# EAGLE board PL20_11 (EAGLE 4.01)
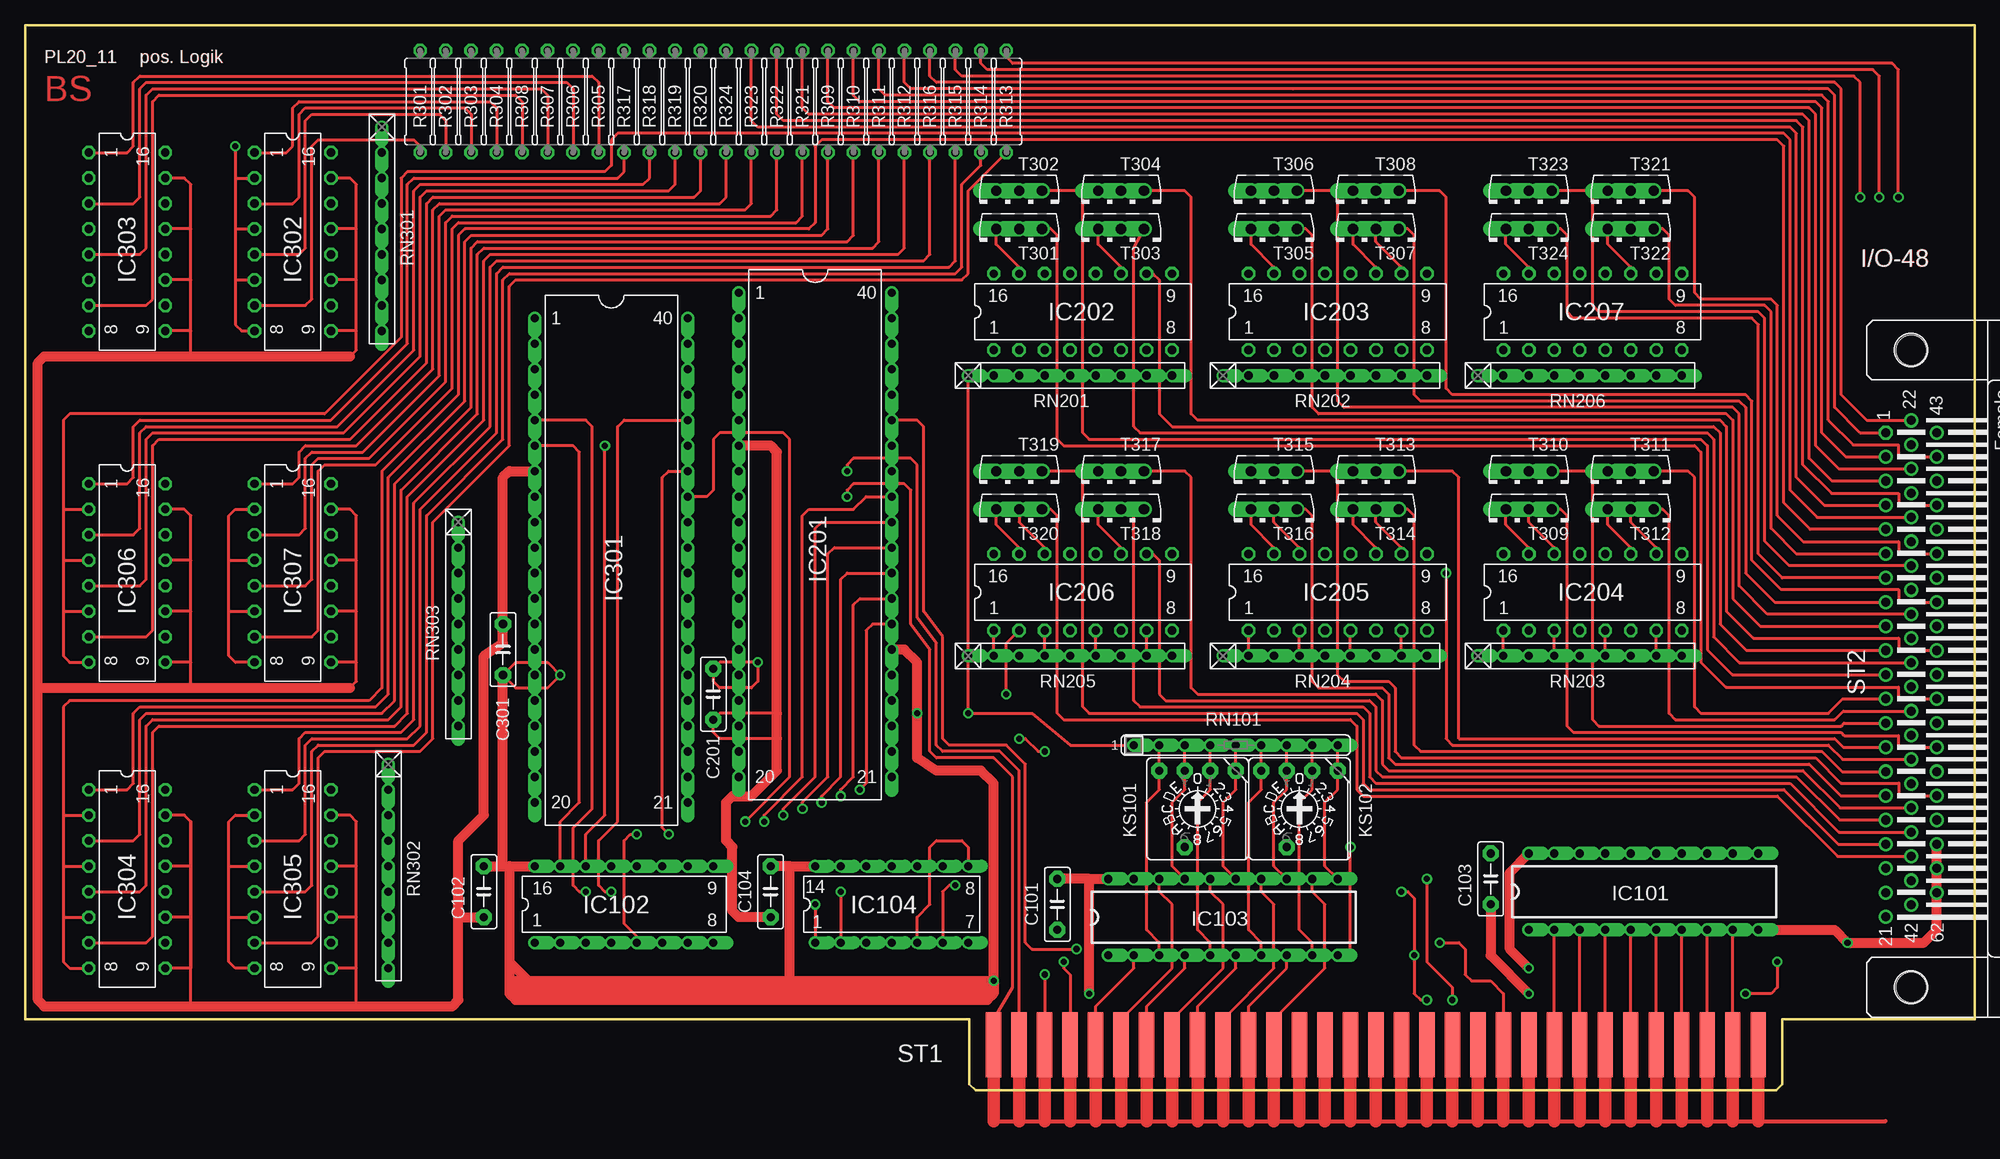
[diagram p3: board, top side]
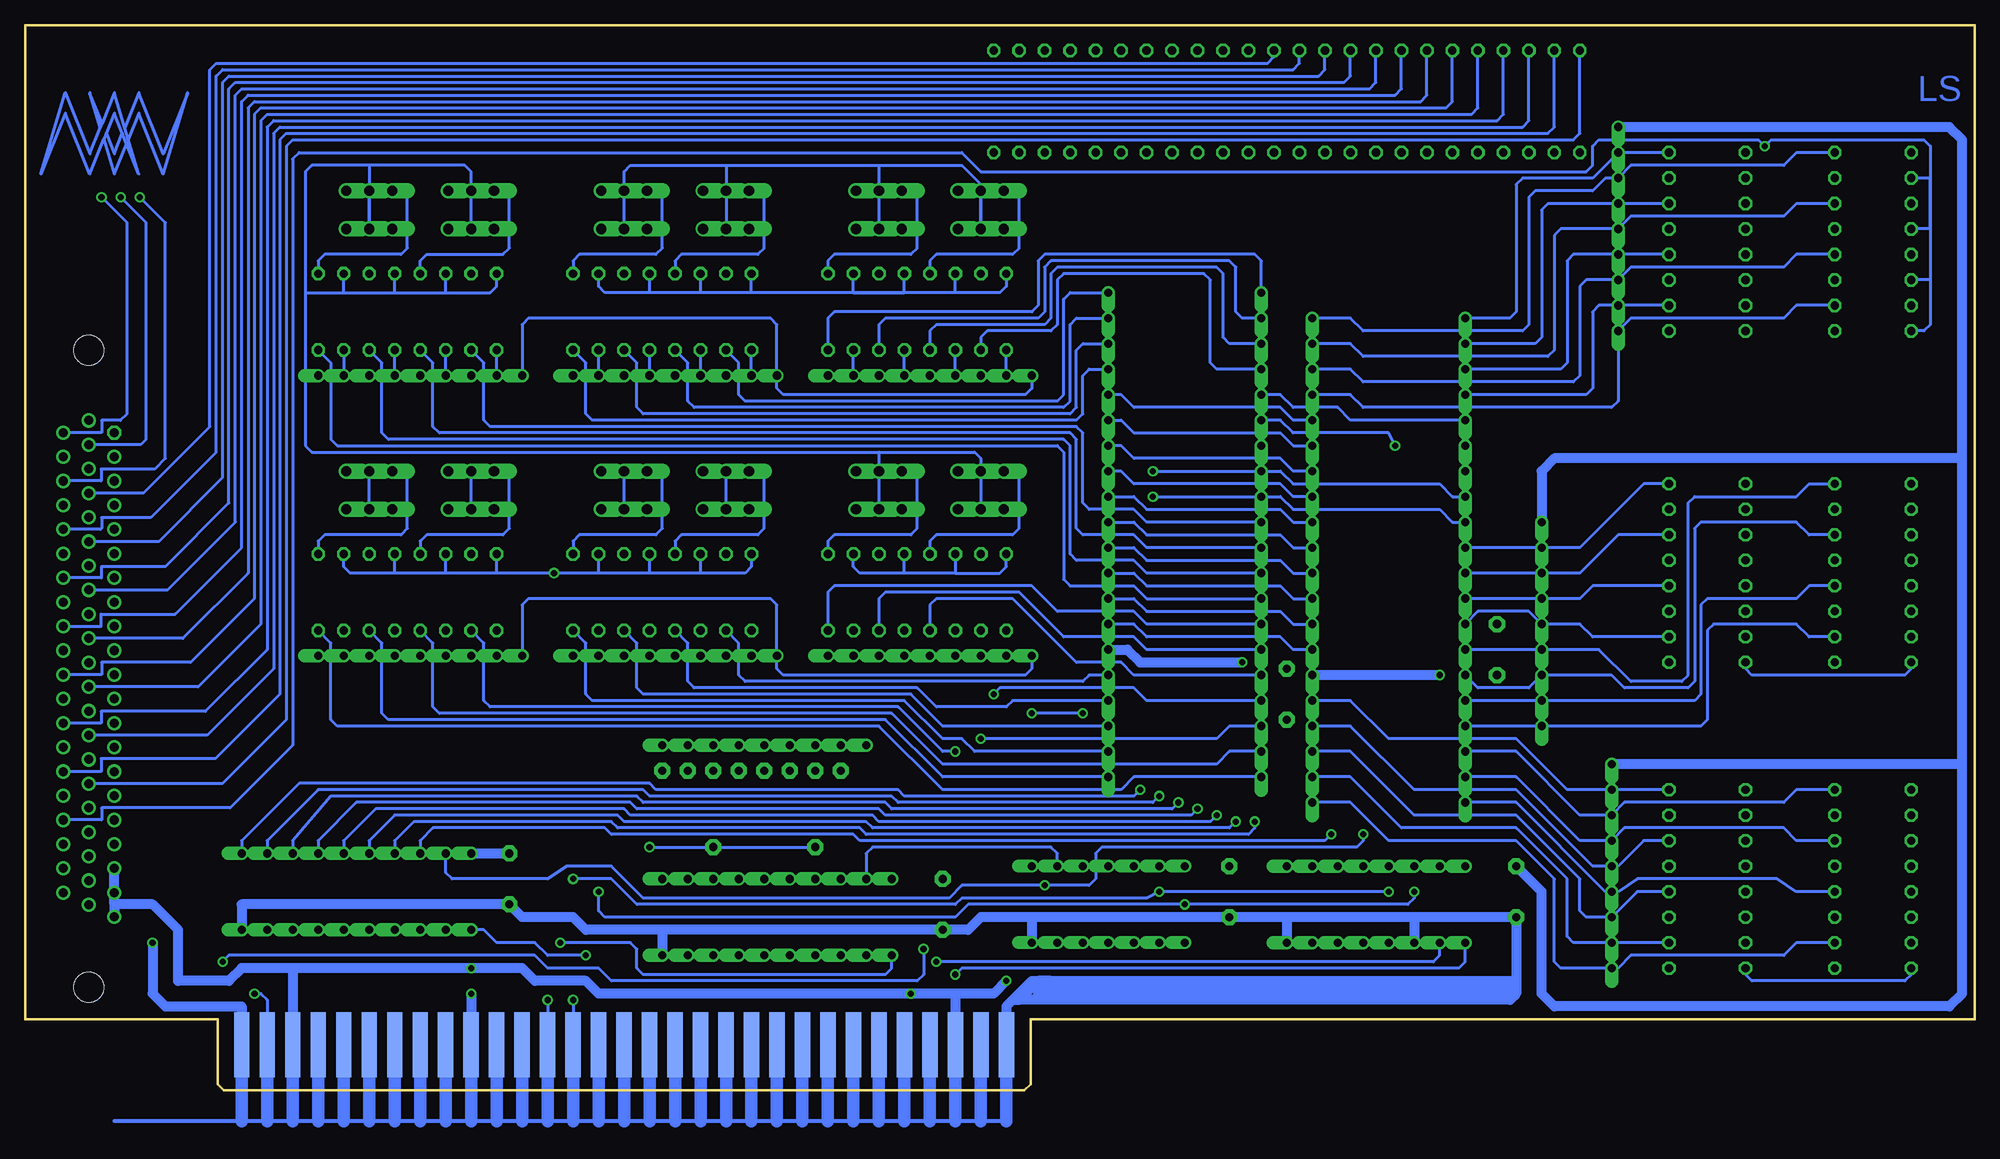
[diagram p4: board, bottom side, seen from below]

Size 194.31 x 106.17 mm. Coordinates in mm from the lower left corner, seen from the top.
Copper layers used: Top, Bottom

## Footprints (pad centres in the part's own frame; a part is rotated, then mirrored left to right if it is on the bottom)
C5B2,5 = drill 0.813 pad 1.6 octagon: 1 -2.54,0; 2 2.54,0
PDIP20 = drill 0.813 offset: 1 -11.43,-3.81; 2 -8.89,-3.81; 3 -6.35,-3.81; 4 -3.81,-3.81; 5 -1.27,-3.81; 6 1.27,-3.81; 7 3.81,-3.81; 8 6.35,-3.81; 9 8.89,-3.81; 10 11.43,-3.81; 11 11.43,3.81; 12 8.89,3.81; 13 6.35,3.81; 14 3.81,3.81; 15 1.27,3.81; 16 -1.27,3.81; 17 -3.81,3.81; 18 -6.35,3.81; 19 -8.89,3.81; 20 -11.43,3.81
DIL16 = drill 0.813 offset: 1 -8.89,-3.81; 2 -6.35,-3.81; 3 -3.81,-3.81; 4 -1.27,-3.81; 5 1.27,-3.81; 6 3.81,-3.81; 7 6.35,-3.81; 8 8.89,-3.81; 9 8.89,3.81; 10 6.35,3.81; 11 3.81,3.81; 12 1.27,3.81; 13 -1.27,3.81; 14 -3.81,3.81; 15 -6.35,3.81; 16 -8.89,3.81
DIL14 = drill 0.8 offset: 1 -7.62,-3.81; 2 -5.08,-3.81; 3 -2.54,-3.81; 4 0,-3.81; 5 2.54,-3.81; 6 5.08,-3.81; 7 7.62,-3.81; 8 7.62,3.81; 9 5.08,3.81; 10 2.54,3.81; 11 0,3.81; 12 -2.54,3.81; 13 -5.08,3.81; 14 -7.62,3.81
DIL40 = drill 0.813 offset: 1 -24.13,-7.62; 2 -21.59,-7.62; 3 -19.05,-7.62; 4 -16.51,-7.62; 5 -13.97,-7.62; 6 -11.43,-7.62; 7 -8.89,-7.62; 8 -6.35,-7.62; 9 -3.81,-7.62; 10 -1.27,-7.62; 11 1.27,-7.62; 12 3.81,-7.62; 13 6.35,-7.62; 14 8.89,-7.62; 15 11.43,-7.62; 16 13.97,-7.62; 17 16.51,-7.62; 18 19.05,-7.62; 19 21.59,-7.62; 20 24.13,-7.62; 21 24.13,7.62; 22 21.59,7.62; 23 19.05,7.62; 24 16.51,7.62; 25 13.97,7.62; 26 11.43,7.62; 27 8.89,7.62; 28 6.35,7.62; 29 3.81,7.62; 30 1.27,7.62; 31 -1.27,7.62; 32 -3.81,7.62; 33 -6.35,7.62; 34 -8.89,7.62; 35 -11.43,7.62; 36 -13.97,7.62; 37 -16.51,7.62; 38 -19.05,7.62; 39 -21.59,7.62; 40 -24.13,7.62
DIL16' = drill 0.813 octagon: 1 -8.89,-3.81; 2 -6.35,-3.81; 3 -3.81,-3.81; 4 -1.27,-3.81; 5 1.27,-3.81; 6 3.81,-3.81; 7 6.35,-3.81; 8 8.89,-3.81; 9 8.89,3.81; 10 6.35,3.81; 11 3.81,3.81; 12 1.27,3.81; 13 -1.27,3.81; 14 -3.81,3.81; 15 -6.35,3.81; 16 -8.89,3.81
S10HEX = drill 0.813 pad 1.6 octagon: 1 3.81,-3.81; 2 1.27,-3.81; 4 -1.27,-3.81; 8 -3.81,-3.81; C 1.27,3.81
0309/10 = drill 0.813 octagon: 1 -5.08,0; 2 5.08,0
SIL9 = drill 0.813 offset: 1 -10.16,0; 2 -7.62,0; 3 -5.08,0; 4 -2.54,0; 5 0,0; 6 2.54,0; 7 5.08,0; 8 7.62,0; 9 10.16,0
RN-9 = drill 0.813 offset: 1 -10.16,0; 2 -7.62,0; 3 -5.08,0; 4 -2.54,0; 5 0,0; 6 2.54,0; 7 5.08,0; 8 7.62,0; 9 10.16,0
8BITPL20 = smd 1.524 x 6.477: A1 172.72,24.13; A2 170.18,24.13; A3 167.64,24.13; A4 165.1,24.13; A5 162.56,24.13; A6 160.02,24.13; A7 157.48,24.13; A8 154.94,24.13; A9 152.4,24.13; A10 149.86,24.13; A11 147.32,24.13; A12 144.78,24.13; A13 142.24,24.13; A14 139.7,24.13; A15 137.16,24.13; A16 134.62,24.13; A17 132.08,24.13; A18 129.54,24.13; A19 127,24.13; A20 124.46,24.13; A21 121.92,24.13; A22 119.38,24.13; A23 116.84,24.13; A24 114.3,24.13; A25 111.76,24.13; A26 109.22,24.13; A27 106.68,24.13; A28 104.14,24.13; A29 101.6,24.13; A30 99.06,24.13; A31 96.52,24.13 | smd 1.524 x 6.477 bottom: B1 172.72,24.13; B2 170.18,24.13; B3 167.64,24.13; B4 165.1,24.13; B5 162.56,24.13; B6 160.02,24.13; B7 157.48,24.13; B8 154.94,24.13; B9 152.4,24.13; B10 149.86,24.13; B11 147.32,24.13; B12 144.78,24.13; B13 142.24,24.13; B14 139.7,24.13; B15 137.16,24.13; B16 134.62,24.13; B17 132.08,24.13; B18 129.54,24.13; B19 127,24.13; B20 124.46,24.13; B21 121.92,24.13; B22 119.38,24.13; B23 116.84,24.13; B24 114.3,24.13; B25 111.76,24.13; B26 109.22,24.13; B27 106.68,24.13; B28 104.14,24.13; B29 101.6,24.13; B30 99.06,24.13; B31 96.52,24.13
HDF62H = drill 0.9 octagon: 1 23.527,2.54 | drill 0.9 round: 2 21.114,2.54; 3 18.701,2.54; 4 16.288,2.54; 5 13.875,2.54; 6 11.462,2.54; 7 9.049,2.54; 8 6.636,2.54; 9 4.223,2.54; 10 1.81,2.54; 11 -0.603,2.54; 12 -3.016,2.54; 13 -5.429,2.54; 14 -7.842,2.54; 15 -10.255,2.54; 16 -12.668,2.54; 17 -15.081,2.54; 18 -17.494,2.54; 19 -19.907,2.54; 20 -22.32,2.54; 21 -24.733,2.54; 22 24.734,0; 23 22.321,0; 24 19.908,0; 25 17.495,0; 26 15.082,0; 27 12.669,0; 28 10.256,0; 29 7.843,0; 30 5.43,0; 31 3.017,0; 32 0.604,0; 33 -1.809,0; 34 -4.222,0; 35 -6.635,0; 36 -9.048,0; 37 -11.461,0; 38 -13.874,0; 39 -16.287,0; 40 -18.7,0; 41 -21.113,0; 42 -23.526,0; 43 23.527,-2.54; 44 21.114,-2.54; 45 18.701,-2.54; 46 16.288,-2.54; 47 13.875,-2.54; 48 11.462,-2.54; 49 9.049,-2.54; 50 6.636,-2.54; 51 4.223,-2.54; 52 1.81,-2.54; 53 -0.603,-2.54; 54 -3.016,-2.54; 55 -5.429,-2.54; 56 -7.842,-2.54; 57 -10.255,-2.54; 58 -12.668,-2.54; 59 -15.081,-2.54; 60 -17.494,-2.54; 61 -19.907,-2.54; 62 -22.32,-2.54 | hole 3: -31.75,0; 31.75,0
TO126AV = drill 1.016 offset: B 2.286,-1.27; C 0,-1.27; E -2.286,-1.27

## Placement (x,y rotation side)
C101  100n  [C5B2,5]  102.87,18.54 90 top
C102  100n  [C5B2,5]  45.72,19.81 90 top
C103  100n  [C5B2,5]  146.05,21.08 90 top
C104  100n  [C5B2,5]  74.29,19.81 90 top
C201  100n  [C5B2,5]  68.58,39.5 90 top
C301  100n  [C5B2,5]  47.63,43.94 270 top
IC101  74245N  [PDIP20]  161.29,19.81 0 top
IC102  74LS138N  [DIL16]  59.69,18.54 0 top
IC103  74688N  [PDIP20]  119.38,17.27 0 top
IC104  74ALS00N  [DIL14]  86.36,18.54 0 top
IC201  [DIL40]  78.74,55.37 270 top
IC202  ILQ620  [DIL16']  105.41,77.6 0 top
IC203  ILQ620  [DIL16']  130.81,77.6 0 top
IC204  ILQ620  [DIL16']  156.21,49.66 0 top
IC205  ILQ620  [DIL16']  130.81,49.66 0 top
IC206  ILQ620  [DIL16']  105.41,49.66 0 top
IC207  ILQ620  [DIL16']  156.21,77.6 0 top
IC301  [DIL40]  58.42,52.83 270 top
IC302  ILQ620  [DIL16']  26.67,84.58 270 top
IC303  ILQ620  [DIL16']  10.16,84.58 270 top
IC304  ILQ620  [DIL16']  10.16,21.08 270 top
IC305  ILQ620  [DIL16']  26.67,21.08 270 top
IC306  ILQ620  [DIL16']  10.16,51.56 270 top
IC307  ILQ620  [DIL16']  26.67,51.56 270 top
KS101  [S10HEX]  116.84,28.07 180 top
KS102  [S10HEX]  127,28.07 180 top
R301  2.2k  [0309/10]  39.37,98.55 90 top
R302  2.2k  [0309/10]  41.91,98.55 90 top
R303  2.2k  [0309/10]  44.45,98.55 90 top
R304  2.2k  [0309/10]  46.99,98.55 90 top
R305  2.2k  [0309/10]  57.15,98.55 90 top
R306  2.2k  [0309/10]  54.61,98.55 90 top
R307  2.2k  [0309/10]  52.07,98.55 90 top
R308  2.2k  [0309/10]  49.53,98.55 90 top
R309  2.2k  [0309/10]  80.01,98.55 90 top
R310  2.2k  [0309/10]  82.55,98.55 90 top
R311  2.2k  [0309/10]  85.09,98.55 90 top
R312  2.2k  [0309/10]  87.63,98.55 90 top
R313  2.2k  [0309/10]  97.79,98.55 90 top
R314  2.2k  [0309/10]  95.25,98.55 90 top
R315  2.2k  [0309/10]  92.71,98.55 90 top
R316  2.2k  [0309/10]  90.17,98.55 90 top
R317  2.2k  [0309/10]  59.69,98.55 90 top
R318  2.2k  [0309/10]  62.23,98.55 90 top
R319  2.2k  [0309/10]  64.77,98.55 90 top
R320  2.2k  [0309/10]  67.31,98.55 90 top
R321  2.2k  [0309/10]  77.47,98.55 90 top
R322  2.2k  [0309/10]  74.93,98.55 90 top
R323  2.2k  [0309/10]  72.39,98.55 90 top
R324  2.2k  [0309/10]  69.85,98.55 90 top
RN101  [SIL9]  120.65,34.42 0 top
RN201  2.2k  [RN-9]  104.14,71.25 0 top
RN202  2.2k  [RN-9]  129.54,71.25 0 top
RN203  2.2k  [RN-9]  154.94,43.31 0 top
RN204  2.2k  [RN-9]  129.54,43.31 0 top
RN205  2.2k  [RN-9]  104.14,43.31 0 top
RN206  2.2k  [RN-9]  154.94,71.25 0 top
RN301  10k  [RN-9]  35.56,85.85 270 top
RN302  10k  [RN-9]  36.2,22.35 270 top
RN303  10k  [RN-9]  43.18,46.48 270 top
ST1  8BITPL20"  [8BITPL20]  0,-19.56 0 top
ST2  [HDF62H]  187.96,42.04 90 top
T301  BD679  [TO126AV]  99.06,84.58 180 top
T302  BD679  [TO126AV]  99.06,88.39 180 top
T303  BD679  [TO126AV]  109.22,84.58 180 top
T304  [TO126AV]  109.22,88.39 180 top
T305  BD679  [TO126AV]  124.46,84.58 180 top
T306  BD679  [TO126AV]  124.46,88.39 180 top
T307  BD679  [TO126AV]  134.62,84.58 180 top
T308  BD679  [TO126AV]  134.62,88.39 180 top
T309  BD679  [TO126AV]  149.86,56.64 180 top
T310  BD679  [TO126AV]  149.86,60.45 180 top
T311  BD679  [TO126AV]  160.02,60.45 180 top
T312  BD679  [TO126AV]  160.02,56.64 180 top
T313  BD679  [TO126AV]  134.62,60.45 180 top
T314  BD679  [TO126AV]  134.62,56.64 180 top
T315  BD679  [TO126AV]  124.46,60.45 180 top
T316  BD679  [TO126AV]  124.46,56.64 180 top
T317  BD679  [TO126AV]  109.22,60.45 180 top
T318  BD679  [TO126AV]  109.22,56.64 180 top
T319  BD679  [TO126AV]  99.06,60.45 180 top
T320  BD679  [TO126AV]  99.06,56.64 180 top
T321  BD679  [TO126AV]  160.02,88.39 180 top
T322  BD679  [TO126AV]  160.02,84.58 180 top
T323  BD679  [TO126AV]  149.86,88.39 180 top
T324  BD679  [TO126AV]  149.86,84.58 180 top
U$48  [DINA4_Q]  -34.29,-56.39 0 top  (outside the outline)

## Tracks (layer width: path | path; a pad name or v marks a point on that pad's centre or on a via)
+5V  (via drill 0.61)
  Top 0.305: RN101.1 104.14,34.42 100.33,37.59 v93.98,37.59 RN205.1 RN201.1 | C301.2 48.9,42.67 52.07,42.67 v53.34,41.4 52.07,40.13 48.9,40.13 C301.2 | 69.22,42.67 C201.2 68.58,40.77 69.22,40.13 72.39,40.13 73.03,40.77 v73.03,42.67 69.22,42.67
  Top 1.016: 47.63,22.35 C301.2 | C102.2 47.63,22.35 | 47.63,22.35 48.26,22.35 | 48.26,22.35 IC102.16 | 76.2,22.35 C104.2 | 76.2,10.92 50.16,10.92 48.26,12.83 | IC201.26 87.63,43.94 88.9,42.67 v88.9,37.59 88.9,33.15 90.81,31.88 95.25,31.88 96.52,30.61 v96.52,10.92 | 48.26,22.35 48.26,12.83 | 106.05,21.08 IC103.20 | 106.05,21.08 C101.2 | v106.05,9.65 106.05,21.08 | 76.2,22.35 IC104.14 | IC101.20 147.96,21.72 147.96,14.1 v149.86,12.19 | 76.2,10.92 76.2,22.35 | 76.2,10.92 v96.52,10.92 | 48.26,12.83 48.26,9.65 48.9,9.02 95.89,9.02 96.52,9.65 v96.52,10.92 | v96.52,10.92 95.25,9.65 49.53,9.65 48.9,10.29 48.9,10.92 49.53,10.29 95.25,10.29
  Bottom 0.305: RN201.1 93.98,69.98 94.62,69.34 118.75,69.34 119.38,69.98 RN202.1 119.38,76.33 120.02,76.96 144.15,76.96 144.78,76.33 RN206.1 | RN203.1 144.78,48.39 144.15,49.02 120.02,49.02 119.38,48.39 RN204.1 119.38,42.04 118.75,41.4 94.62,41.4 93.98,42.04 RN205.1 | 185.42,21.72 ST2.20 185.42,18.54 | IC101.20 C103.2 | v88.9,37.59 v93.98,37.59
  Bottom 1.016: RN301.1 2.54,96.01 1.27,94.74 1.27,62.99 | RN303.1 43.18,61.72 41.91,62.99 1.27,62.99 | 1.27,32.51 1.27,62.99 | 1.27,32.51 RN302.1 | 1.27,32.51 1.27,9.65 2.54,8.38 41.91,8.38 43.18,9.65 43.18,19.81 C102.2 | 101.6,9.65 ST1.B29 | v96.52,10.92 97.79,9.65 101.6,9.65 | 101.6,9.65 v106.05,9.65 137.16,9.65 138.43,10.92 143.51,10.92 144.78,12.19 v149.86,12.19 167.64,12.19 | 185.42,18.54 ST2.21 | 185.42,18.54 185.42,21.72 ST2.19 | 185.42,18.54 181.61,18.54 179.07,16 179.07,10.92 173.99,10.92 172.72,12.19 167.64,12.19 | IC101.20 C103.2 | IC201.26 84.46,43.94 83.19,42.67 v73.03,42.67 | 167.64,12.19 ST1.B3 | v53.34,41.4 IC301.26
ADR0  (via drill 0.61)
  Top 0.305: v81.91,59.18 81.91,59.82 82.55,60.45 87.63,60.45 88.27,59.82 88.27,46.48 90.17,43.94 90.17,33.78 90.81,33.15 96.52,33.15 98.43,31.24 98.43,10.29 96.52,7.11 ST1.A31
  Bottom 0.305: IC301.9 52.07,56.64 53.34,57.91 67.94,57.91 69.22,59.18 IC201.9 v81.91,59.18
ADR1  (via drill 0.61)
  Top 0.305: v81.91,61.72 81.91,62.36 82.55,62.99 88.27,62.99 88.9,62.36 88.9,47.12 90.81,44.58 90.81,34.42 91.44,33.78 97.16,33.78 99.06,31.88 ST1.A30
  Bottom 0.305: IC301.8 52.07,59.18 53.34,60.45 67.94,60.45 69.22,61.72 IC201.8 v81.91,61.72
ADR4
  Top 0.305: IC103.2 110.49,12.19 106.68,8.38 ST1.A27
ADR5
  Top 0.305: IC103.18 113.03,19.81 114.3,18.54 114.3,12.19 109.22,7.11 ST1.A26
ADR6
  Top 0.305: IC103.4 115.57,12.19 111.76,8.38 ST1.A25
ADR7
  Top 0.305: IC103.16 118.11,19.81 119.38,18.54 119.38,12.19 114.3,7.11 ST1.A24
ADR8
  Top 0.305: IC103.6 120.65,12.19 116.84,8.38 ST1.A23
ADR9
  Top 0.305: IC103.14 123.19,19.81 124.46,18.54 124.46,12.19 119.38,7.11 ST1.A22
ADR10
  Top 0.305: IC103.8 125.73,12.19 121.92,8.38 ST1.A21
ADR11
  Top 0.305: IC103.12 128.27,19.81 129.54,18.54 129.54,12.19 124.46,7.11 ST1.A20
AEN  (via drill 0.61)
  Top 0.305: v140.97,14.73 142.88,14.73 143.51,14.1 143.51,11.56 144.15,10.92 146.05,10.92 147.32,9.65 ST1.A11
  Bottom 0.305: IC103.1 107.95,12.19 108.59,11.56 132.72,11.56 133.35,12.19 133.35,14.1 133.99,14.73 v140.97,14.73
CS1
  Top 0.305: IC102.15 53.34,26.8 55.24,28.7 55.24,63.63 54.61,64.26 IC301.6
CS2  (via drill 0.61)
  Top 0.305: IC102.14 55.88,25.53 57.79,27.43 v57.79,64.26
  Bottom 0.305: v57.79,64.26 58.42,65.53 67.94,65.53 69.22,66.8 IC201.6
D0
  Top 0.305: ST1.A9 IC101.2
D1
  Top 0.305: ST1.A8 IC101.3
D2
  Top 0.305: ST1.A7 IC101.4
D3
  Top 0.305: ST1.A6 IC101.5
D4
  Top 0.305: ST1.A5 IC101.6
D5
  Top 0.305: ST1.A4 IC101.7
D6
  Top 0.305: ST1.A3 IC101.8
D7
  Top 0.305: ST1.A2 IC101.9
DA0  (via drill 0.61)
  Top 0.305: v64.13,25.53 63.5,26.16 63.5,61.09 64.13,61.72 IC301.34
  Bottom 0.305: IC301.34 67.94,61.72 69.22,62.99 83.82,62.99 85.09,64.26 IC201.34 | IC101.18 154.94,24.89 153.67,26.16 136.53,26.16 135.89,25.53 111.76,25.53 111.12,24.89 64.77,24.89 v64.13,25.53
DA1  (via drill 0.61)
  Top 0.305: v71.75,26.8 76.2,31.24 76.2,64.9 75.56,65.53 69.22,65.53 68.58,64.9 68.58,59.82 67.94,59.18 IC301.33
  Bottom 0.305: IC301.33 67.94,59.18 69.22,60.45 83.82,60.45 85.09,61.72 IC201.33 | IC101.17 157.48,24.89 155.58,26.8 135.89,26.8 135.25,26.16 111.12,26.16 110.49,25.53 72.39,25.53 71.75,26.16 v71.75,26.8
DA2  (via drill 0.61)
  Top 0.305: v73.66,26.8 73.66,27.43 77.47,31.24 77.47,57.28 78.1,57.91 82.55,57.91 83.82,59.18 IC201.32
  Bottom 0.305: IC301.32 67.94,56.64 69.22,57.91 82.55,57.91 83.82,59.18 IC201.32 | IC101.16 160.02,24.89 157.48,27.43 135.25,27.43 134.62,26.8 110.49,26.8 109.86,26.16 74.29,26.16 v73.66,26.8
DA3  (via drill 0.61)
  Top 0.305: v75.56,27.43 75.56,28.07 78.74,31.24 78.74,56.01 79.38,56.64 IC201.31
  Bottom 0.305: IC301.31 67.94,54.1 69.22,55.37 82.55,55.37 83.82,56.64 IC201.31 | IC101.15 162.56,24.89 159.39,28.07 134.62,28.07 133.99,27.43 109.86,27.43 109.22,26.8 76.2,26.8 v75.56,27.43
DA4  (via drill 0.61)
  Top 0.305: v77.47,28.07 77.47,28.7 80.01,31.24 80.01,53.47 80.65,54.1 IC201.30
  Bottom 0.305: IC301.30 67.94,51.56 69.22,52.83 82.55,52.83 83.82,54.1 IC201.30 | IC101.14 165.1,24.89 161.29,28.7 133.99,28.7 133.35,28.07 109.22,28.07 108.59,27.43 78.1,27.43 v77.47,28.07
DA5  (via drill 0.61)
  Top 0.305: v79.38,28.7 79.38,29.34 81.28,31.24 81.28,50.93 81.91,51.56 IC201.29
  Bottom 0.305: IC301.29 67.94,49.02 69.22,50.29 82.55,50.29 83.82,51.56 IC201.29 | IC101.13 167.64,24.89 163.83,29.34 133.35,29.34 132.72,28.7 108.59,28.7 107.95,28.07 80.01,28.07 v79.38,28.7
DA6  (via drill 0.61)
  Top 0.305: v81.28,29.34 81.28,29.97 82.55,31.24 82.55,48.39 83.19,49.02 IC201.28
  Bottom 0.305: IC301.28 67.94,46.48 69.22,47.75 82.55,47.75 83.82,49.02 IC201.28 | IC101.12 170.18,24.89 165.1,29.97 132.72,29.97 132.08,29.34 107.95,29.34 107.31,28.7 81.91,28.7 v81.28,29.34
DA7  (via drill 0.61)
  Top 0.305: v83.19,29.97 83.82,30.61 83.82,45.85 84.46,46.48 IC201.27
  Bottom 0.305: IC301.27 67.94,43.94 69.22,45.21 82.55,45.21 83.82,46.48 IC201.27 | IC101.11 172.72,24.89 167,30.61 132.08,30.61 131.45,29.97 107.31,29.97 106.68,29.34 83.82,29.34 v83.19,29.97
GND  (via drill 0.61)
  Top 0.305: 16.51,85.85 IC303.13 | 16.51,80.77 IC303.11 | 16.51,75.69 IC303.9 | IC303.15 15.88,90.93 16.51,90.3 16.51,85.85 | 16.51,80.77 16.51,85.85 | 16.51,75.69 16.51,80.77 | 16.51,75.69 16.51,73.15 32.38,73.15 33.02,73.79 33.02,75.69 | IC302.15 32.38,90.93 33.02,90.3 33.02,85.85 | 33.02,85.85 IC302.13 | 33.02,80.77 33.02,85.85 | 33.02,80.77 IC302.11 | 33.02,75.69 33.02,80.77 | 33.02,75.69 IC302.9 | 32.38,40.13 33.02,40.77 33.02,42.67 | IC307.15 32.38,57.91 33.02,57.28 33.02,52.83 | 33.02,52.83 IC307.13 | 33.02,47.75 33.02,52.83 | 33.02,47.75 IC307.11 | 33.02,42.67 33.02,47.75 | 33.02,42.67 IC307.9 | IC306.15 15.88,57.91 16.51,57.28 16.51,52.83 | 16.51,52.83 IC306.13 | 16.51,47.75 16.51,52.83 | 16.51,47.75 IC306.11 | 16.51,42.67 16.51,47.75 | 16.51,42.67 IC306.9 | 16.51,40.13 16.51,42.67 | 33.02,8.38 33.02,12.19 | 33.02,12.19 IC305.9 | 33.02,12.19 33.02,17.27 | 33.02,17.27 IC305.11 | 33.02,17.27 33.02,22.35 | 33.02,22.35 IC305.13 | IC304.15 15.88,27.43 16.51,26.8 | 16.51,26.8 16.51,22.35 | 16.51,22.35 IC304.13 | 16.51,22.35 16.51,17.27 | 16.51,17.27 IC304.11 | 16.51,17.27 16.51,12.19 IC304.9 | 16.51,8.38 16.51,26.8 | IC305.15 32.38,27.43 33.02,26.8 33.02,22.35 | v132.08,24.26 132.08,14.1 131.45,13.46 IC103.10 | 74.93,37.59 69.22,37.59 C201.1 68.58,35.69 69.22,35.05 74.93,35.05
  Top 1.016: IC101.10 180.34,16 v181.61,14.73 189.23,14.73 190.5,16 ST2.62 ST2.61 ST2.60 | 32.38,73.15 1.91,73.15 1.27,72.52 1.27,40.13 | 32.38,40.13 16.51,40.13 1.27,40.13 | 1.27,40.13 1.27,9.02 1.91,8.38 16.51,8.38 33.02,8.38 42.54,8.38 43.18,9.02 43.18,17.27 | IC301.7 48.26,61.72 47.63,61.09 C301.1 47.63,44.58 45.72,43.31 45.72,27.43 43.18,24.89 43.18,17.27 | 43.18,17.27 C102.1 | IC201.7 74.29,64.26 74.93,63.63 74.93,37.59 74.93,35.05 74.93,31.88 72.39,29.34 70.49,29.34 69.85,28.7 69.85,24.89 70.49,24.26 70.49,17.91 71.12,17.27 C104.1 | C103.1 146.05,13.46 v149.86,9.65
  Bottom 0.305: 149.86,7.11 ST1.B10 | KS102.C v132.08,24.26 KS102.C | KS102.C KS101.C
  Bottom 1.016: 55.88,17.27 C102.1 45.72,9.65 46.35,9.02 95.89,9.02 | 55.88,17.27 IC102.3 | 55.88,17.27 68.58,17.27 | 68.58,17.27 IC102.8 | 68.58,17.27 C104.1 93.98,17.27 | 93.98,17.27 IC104.7 | 93.98,17.27 99.06,17.27 100.33,16 C101.1 130.81,16 | v149.86,9.65 149.86,7.11 | 130.81,16 138.43,16 139.7,17.27 144.78,17.27 C103.1 172.72,18.54 IC101.10 | 130.81,16 IC103.10 | ST1.B1 172.72,8.38 180.34,8.38 181.61,9.65 v181.61,14.73 | ST1.B31 96.52,8.38 95.89,9.02 | 95.89,9.02 95.25,9.02 93.34,10.92 92.07,10.92 | 92.07,10.92 46.35,10.92 46.35,10.29 92.71,10.29 93.34,9.65 46.35,9.65 | 95.89,9.02 93.98,10.92 92.07,10.92
N$1
  Top 0.305: IC103.3 113.03,14.73 111.76,16 111.76,28.7 113.03,29.97 KS101.1 RN101.2
N$2
  Top 0.305: IC103.17 114.3,22.35 114.3,28.7 115.57,29.97 KS101.2 RN101.3
N$3
  Top 0.305: IC103.5 118.11,14.73 116.84,16 116.84,28.7 118.11,29.97 KS101.4 RN101.4
N$4
  Top 0.305: IC103.15 119.38,22.35 119.38,28.7 120.65,29.97 KS101.8 RN101.5
N$5
  Top 0.305: IC103.7 123.19,14.73 121.92,16 121.92,28.7 123.19,29.97 KS102.1 RN101.6
N$6
  Top 0.305: IC103.13 124.46,22.35 124.46,28.7 125.73,29.97 KS102.2 RN101.7
N$7
  Top 0.305: IC103.9 128.27,14.73 127,16 127,28.7 128.27,29.97 KS102.4 RN101.8
N$8
  Top 0.305: IC103.11 129.54,22.35 129.54,28.7 130.81,29.97 KS102.8 RN101.9
N$9
  Bottom 0.305: IC104.10 IC104.9 91.44,23.62 92.07,24.26 109.86,24.26 110.49,23.62 IC103.19
N$10  (via drill 0.61)
  Top 0.305: v103.5,12.83 103.5,12.19 104.14,11.56 ST1.A28
  Bottom 0.305: IC102.2 53.34,13.46 53.98,12.83 v103.5,12.83
N$11  (via drill 0.61)
  Top 0.305: IC102.5 60.96,15.37 59.69,16.64 59.69,24.89 60.32,25.53 v60.96,25.53 | v92.71,20.45 92.07,20.45 91.44,19.81 IC104.6
  Bottom 0.305: IC102.4 IC102.5 | v60.96,25.53 60.96,24.89 61.6,24.26 87,24.26 87.63,23.62 87.63,21.08 88.27,20.45 v92.71,20.45 100.97,20.45 102.24,19.18 132.72,19.18 135.89,22.35 140.34,22.35 142.24,21.08 151.77,21.08 152.4,21.72 IC101.19
N$12
  Top 0.305: R316.1 90.17,83.31 89.53,82.68 46.99,82.68 46.35,82.04 46.35,66.17 38.74,58.55 38.74,36.96 37.46,35.69 27.94,35.69 27.3,35.05 27.3,30.61 26.67,29.97 IC305.1
N$13
  Top 0.305: R315.1 92.71,82.68 92.07,82.04 47.63,82.04 46.99,81.41 46.99,65.53 39.37,57.91 39.37,36.32 38.1,35.05 28.58,35.05 27.94,34.42 27.94,25.53 27.3,24.89 IC305.3
N$14
  Top 0.305: R314.1 95.25,92.2 93.34,90.3 93.34,82.04 92.71,81.41 48.26,81.41 47.63,80.77 47.63,64.9 40.01,57.28 40.01,35.69 38.74,34.42 29.21,34.42 28.58,33.78 28.58,20.45 27.94,19.81 IC305.5
N$15
  Top 0.305: R313.1 93.98,89.66 93.98,81.41 93.34,80.77 48.9,80.77 48.26,80.14 48.26,64.26 40.64,56.64 40.64,35.05 39.37,33.78 29.85,33.78 29.21,33.15 29.21,15.37 28.58,14.73 IC305.7
N$16
  Top 0.305: IC104.5 88.9,17.27 90.17,18.54 90.17,24.26 90.81,24.89 93.34,24.89 93.98,24.26 IC104.8
N$17
  Bottom 0.305: IC104.3 IC104.4
N$18  (via drill 0.61)
  Top 0.305: v101.6,11.56 ST1.A29
  Bottom 0.305: IC102.1 50.8,12.83 51.43,12.19 100.97,12.19 v101.6,11.56
N$19
  Top 0.305: T301.B 96.77,84.33 99.06,82.04 IC202.15
N$20
  Top 0.305: R312.1 87.63,83.95 87,83.31 46.35,83.31 45.72,82.68 45.72,66.8 38.1,59.18 38.1,37.59 36.83,36.32 13.34,36.32 12.7,35.69 12.7,15.37 12.06,14.73 IC304.7
N$21
  Top 0.305: R311.1 85.09,84.58 84.46,83.95 45.72,83.95 45.09,83.31 45.09,67.44 37.46,59.82 37.46,38.23 36.2,36.96 12.7,36.96 12.06,36.32 12.06,20.45 11.43,19.81 IC304.5
N$22
  Bottom 0.305: IC202.13 104.14,82.68 103.5,83.31 95.89,83.31 95.25,83.95 95.25,89.03 95.89,89.66 T302.B
N$23
  Top 0.305: T303.B 106.93,84.33 109.22,82.04 IC202.11
N$24
  Bottom 0.305: IC202.9 114.3,82.68 113.67,83.31 106.05,83.31 105.41,83.95 105.41,89.03 106.05,89.66 T304.B
N$25
  Top 0.305: T305.B 122.17,84.33 124.46,82.04 IC203.15
N$26
  Bottom 0.305: IC203.13 129.54,82.68 128.91,83.31 121.28,83.31 120.65,83.95 120.65,89.03 121.28,89.66 T306.B
N$27
  Top 0.305: T307.B 132.33,84.33 134.62,82.04 IC203.11
N$28
  Bottom 0.305: IC203.9 139.7,82.68 139.06,83.31 131.45,83.31 130.81,83.95 130.81,89.03 131.45,89.66 T308.B
N$29
  Top 0.305: ST2.10 171.55,43.85 168.91,46.48 168.91,65.53 168.28,66.17 114.3,66.17 113.03,67.44 113.03,80.77 112.4,81.41 IC202.10 | T307.C 134.62,84.58 137.16,82.04 IC203.10
  Bottom 0.305: IC203.10 137.16,80.14 136.53,79.5 132.08,79.5 | 132.08,79.5 IC203.12 | 127,79.5 132.08,79.5 | 127,79.5 IC203.14 | 121.92,79.5 127,79.5 | 121.92,79.5 IC203.16 | 111.76,79.5 121.92,79.5 | 111.76,79.5 106.68,79.5 | 106.68,79.5 IC202.12 | 101.6,79.5 106.68,79.5 | 101.6,79.5 IC202.14 | 97.16,79.5 101.6,79.5 | T302.C T301.C 99.06,90.3 100.97,92.2 109.22,92.2 | 124.46,92.2 109.22,92.2 | 124.46,92.2 T306.C T305.C 124.46,92.2 | 124.46,92.2 133.99,92.2 134.62,91.57 T308.C T307.C | 111.76,79.5 IC202.10 | 97.16,79.5 111.76,79.5 | 97.16,79.5 96.52,80.14 IC202.16 | T303.C T304.C 109.22,92.2
N$30
  Top 0.305: ST2.54 186.68,39.02 186.68,40.19 169.49,40.19 167,42.67 167,63.63 166.37,64.26 103.5,64.26 102.87,64.9 102.87,85.22 102.24,85.85 T301.E
N$31
  Top 0.305: ST2.11 170.15,41.43 167.64,43.94 167.64,64.26 167,64.9 106.05,64.9 105.41,65.53 105.41,89.03 104.78,89.66 T302.E
N$32
  Top 0.305: ST2.32 170.85,42.64 168.28,45.21 168.28,64.9 167.64,65.53 111.12,65.53 110.49,66.17 110.49,83.95 T303.E
N$33
  Top 0.305: ST2.52 186.72,43.85 186.72,45.07 172.23,45.07 169.55,47.75 169.55,66.17 168.91,66.8 116.84,66.8 116.21,67.44 116.21,89.03 115.57,89.66 T304.E
N$34
  Top 0.305: ST2.9 172.94,46.26 170.18,49.02 170.18,66.8 169.55,67.44 128.91,67.44 128.27,68.07 128.27,85.22 127.64,85.85 T305.E
N$35
  Top 0.305: ST2.30 173.64,47.47 170.81,50.29 170.81,67.44 170.18,68.07 131.45,68.07 130.81,68.71 130.81,89.03 130.18,89.66 T306.E
N$36
  Top 0.305: ST2.8 174.34,48.67 171.45,51.56 171.45,68.07 170.81,68.71 139.06,68.71 138.43,69.34 138.43,85.22 137.8,85.85 T307.E
N$37
  Bottom 0.305: ST2.29 180.12,49.88 173.36,56.64 173.36,99.19 172.72,99.82 60.32,99.82 59.69,100.46 R317.2
N$38
  Top 0.305: ST2.50 186.7,48.67 186.7,49.92 175,49.92 172.09,52.83 172.09,68.71 171.45,69.34 142.24,69.34 141.61,69.98 141.61,89.03 140.97,89.66 T308.E
N$39
  Top 0.305: ST2.56 186.68,34.2 186.68,35.37 181.3,35.37 180.97,35.69 154.31,35.69 153.67,36.32 153.67,57.28 153.03,57.91 T309.E
N$40
  Top 0.305: T309.B 147.57,56.39 149.86,54.1 IC204.15
N$41  (via drill 0.61)
  Top 0.305: ST2.36 181.13,32.99 179.71,34.42 142.24,34.42 141.61,35.05 v141.61,51.56 | T316.C 124.46,56.64 127,54.1 IC205.14 | T309.C 149.86,56.64 152.4,54.1 IC204.14 | T314.C 134.62,56.64 137.16,54.1 IC205.10 | T312.C 160.02,56.64 162.56,54.1 IC204.10
  Bottom 0.305: IC205.16 121.92,52.2 122.56,51.56 127,51.56 | 127,51.56 IC205.14 | 127,51.56 132.08,51.56 | 132.08,51.56 IC205.12 | 132.08,51.56 137.16,51.56 | 147.32,51.56 v141.61,51.56 137.16,51.56 | 147.32,51.56 IC204.16 | 147.32,51.56 152.4,51.56 | 152.4,51.56 153.03,51.56 | 152.4,51.56 IC204.14 | 152.4,51.56 157.48,51.56 | 157.48,51.56 IC204.12 | 157.48,51.56 161.93,51.56 162.56,52.2 IC204.10 | T316.C T315.C | T314.C T313.C | 137.16,51.56 IC205.10 | T309.C T310.C | T312.C T311.C
N$42
  Bottom 0.305: IC204.13 154.94,54.74 154.31,55.37 146.69,55.37 146.05,56.01 146.05,61.09 146.69,61.72 T310.B
N$43
  Bottom 0.305: IC205.9 139.7,54.74 139.06,55.37 131.45,55.37 130.81,56.01 130.81,61.09 131.45,61.72 T313.B
N$44
  Top 0.305: ST2.13 181.26,36.61 180.97,36.32 156.84,36.32 156.21,36.96 156.21,61.09 155.58,61.72 T310.E
N$45
  Top 0.305: ST2.12 181.13,39.02 179.71,37.59 167,37.59 166.37,38.23 166.37,61.09 165.74,61.72 T311.E
N$46
  Bottom 0.305: IC204.9 165.1,54.74 164.47,55.37 156.84,55.37 156.21,56.01 156.21,61.09 156.84,61.72 T311.B
N$47
  Bottom 0.305: RN201.2 IC202.1
N$48
  Bottom 0.305: RN201.4 IC202.3
N$49
  Top 0.305: T312.B 157.73,56.39 160.02,54.1 IC204.11
N$50
  Top 0.305: ST2.34 181.2,37.82 180.34,36.96 164.47,36.96 163.83,37.59 163.83,57.28 163.2,57.91 T312.E
N$51
  Bottom 0.305: RN201.6 IC202.5
N$52
  Bottom 0.305: RN201.8 IC202.7
N$53
  Top 0.305: ST2.14 181.2,34.2 180.34,35.05 142.88,35.05 142.88,61.09 142.24,61.72 T313.E
N$54
  Bottom 0.305: RN202.6 IC203.5
N$55
  Top 0.305: T314.B 132.33,56.39 134.62,54.1 IC205.11
N$56
  Top 0.305: ST2.15 181.07,31.78 179.07,33.78 139.06,33.78 138.43,34.42 138.43,57.28 137.8,57.91 T314.E
N$57
  Bottom 0.305: RN202.8 IC203.7
N$58
  Bottom 0.305: IC205.13 129.54,54.74 128.91,55.37 121.28,55.37 120.65,56.01 120.65,61.09 121.28,61.72 T315.B
N$59
  Top 0.305: ST2.58 186.73,29.37 186.73,30.62 180.96,30.62 178.44,33.15 137.16,33.15 136.53,33.78 136.53,40.13 135.89,40.77 131.45,40.77 130.81,41.4 130.81,61.09 130.18,61.72 T315.E
N$60
  Top 0.305: RN203.2 IC204.1
N$61
  Top 0.305: T316.B 122.17,56.39 124.46,54.1 IC205.15
N$62
  Top 0.305: ST2.16 181.01,29.37 180.97,29.34 177.8,32.51 136.53,32.51 135.89,33.15 135.89,39.5 135.25,40.13 128.91,40.13 128.27,40.77 128.27,57.28 127.64,57.91 T316.E
N$63
  Top 0.305: RN203.4 IC204.3
N$64
  Top 0.305: RN203.8 IC204.7
N$65
  Top 0.305: RN203.6 IC204.5
N$66
  Top 0.305: RN204.8 IC205.7
N$67
  Bottom 0.305: RN202.2 IC203.1
N$68
  Bottom 0.305: RN202.4 IC203.3
N$69
  Top 0.305: RN204.6 IC205.5
N$70
  Top 0.305: RN204.4 IC205.3
N$71
  Top 0.305: RN204.2 IC205.1
N$72
  Top 0.305: ST2.17 180.82,26.96 176.53,31.24 135.25,31.24 134.62,31.88 134.62,38.23 133.99,38.86 113.67,38.86 113.03,39.5 113.03,52.83 112.4,53.47 IC206.10 | T320.C 99.06,56.64 101.6,54.1 IC206.14
  Bottom 0.305: IC207.16 147.32,80.14 147.96,79.5 152.4,79.5 | 152.4,79.5 IC207.14 | 157.48,79.5 152.4,79.5 | 157.48,79.5 IC207.12 | 162.56,79.5 IC207.10 | T324.C T323.C T324.C | 166.37,79.5 162.56,79.5 | 162.56,79.5 157.48,79.5 | 166.37,79.5 166.37,64.26 165.74,63.63 109.22,63.63 | T324.C 149.86,91.57 150.5,92.2 160.02,92.2 | 160.02,92.2 T322.C T321.C | 160.02,92.2 165.74,92.2 166.37,91.57 166.37,79.5 | IC206.16 96.52,52.2 97.16,51.56 101.6,51.56 | IC206.14 101.6,51.56 | 101.6,51.56 106.68,51.56 | 106.68,51.56 IC206.12 | 106.68,51.56 111.12,51.56 111.76,52.2 IC206.10 | 109.22,63.63 T317.C T318.C 109.22,63.63 | 99.06,62.99 T319.C | 109.22,63.63 99.7,63.63 99.06,62.99 | 99.06,62.99 T320.C
N$73
  Bottom 0.305: IC206.9 114.3,54.74 113.67,55.37 106.05,55.37 105.41,56.01 105.41,61.09 106.05,61.72 T317.B
N$74
  Top 0.305: T318.B 106.93,56.39 109.22,54.1 IC206.11
N$75
  Bottom 0.305: IC206.13 104.14,54.74 103.5,55.37 95.89,55.37 95.25,56.01 95.25,61.09 95.89,61.72 T319.B
N$76
  Top 0.305: T320.B 96.77,56.39 99.06,54.1 IC206.15
N$77
  Bottom 0.305: IC207.9 165.1,82.68 164.47,83.31 156.84,83.31 156.21,83.95 156.21,89.03 156.84,89.66 T321.B
N$78
  Top 0.305: IC207.11 160.02,82.04 157.73,84.33 T322.B
N$79
  Bottom 0.305: IC207.13 154.94,82.68 154.31,83.31 146.69,83.31 146.05,83.95 146.05,89.03 146.69,89.66 T323.B
N$80
  Top 0.305: T324.B 147.57,84.33 149.86,82.04 IC207.15
N$81
  Top 0.305: ST2.38 180.88,28.16 177.17,31.88 135.89,31.88 135.25,32.51 135.25,38.86 134.62,39.5 116.84,39.5 116.21,40.13 116.21,61.09 115.57,61.72 T317.E
N$82
  Top 0.305: ST2.39 180.75,25.75 175.9,30.61 134.62,30.61 133.99,31.24 133.99,37.59 133.35,38.23 111.12,38.23 110.49,38.86 110.49,57.28 111.12,57.91 T318.E
N$83
  Top 0.305: ST2.18 180.69,24.54 175.26,29.97 133.99,29.97 133.35,30.61 133.35,36.96 132.72,37.59 106.05,37.59 105.41,38.23 105.41,61.09 104.78,61.72 T319.E
N$84
  Top 0.305: ST2.40 180.62,23.34 174.62,29.34 133.35,29.34 132.72,29.97 132.72,36.32 132.08,36.96 103.5,36.96 102.87,37.59 102.87,57.28 102.24,57.91 T320.E
N$85
  Top 0.305: ST2.48 186.7,53.5 186.7,54.71 177.2,54.71 174.62,57.28 174.62,78.23 173.99,78.87 167,78.87 166.37,79.5 166.37,89.03 165.74,89.66 T321.E
N$86
  Top 0.305: ST2.6 185.42,53.47 176.53,53.47 173.99,56.01 173.99,77.6 173.36,78.23 164.47,78.23 163.83,78.87 163.83,85.22 163.2,85.85 T322.E
N$87
  Top 0.305: ST2.28 175.8,52.29 173.36,54.74 173.36,76.96 172.72,77.6 156.84,77.6 156.21,78.23 156.21,89.03 155.58,89.66 T323.E
N$88
  Top 0.305: ST2.7 175.1,51.09 172.72,53.47 172.72,76.33 172.09,76.96 154.31,76.96 153.67,77.6 153.67,85.22 153.03,85.85 T324.E
N$89
  Top 0.305: RN205.8 IC206.7
N$90
  Top 0.305: RN205.6 IC206.5
N$91
  Top 0.305: RN205.4 IC206.3
N$92
  Top 0.305: RN205.2 IC206.1
N$93
  Bottom 0.305: IC207.7 RN206.8
N$94
  Bottom 0.305: RN206.4 IC207.3
N$95
  Bottom 0.305: RN206.6 IC207.5
N$96
  Bottom 0.305: RN206.2 IC207.1
N$97
  Top 0.305: R317.1 59.69,91.57 59.05,90.93 38.74,90.93 38.1,90.3 38.1,74.42 30.48,66.8 11.43,66.8 10.8,66.17 10.8,61.09 10.16,60.45 IC306.1
N$98
  Top 0.305: R318.1 62.23,90.93 61.6,90.3 39.37,90.3 38.74,89.66 38.74,73.79 31.12,66.17 12.06,66.17 11.43,65.53 11.43,56.01 10.8,55.37 IC306.3
N$99
  Top 0.305: R319.1 64.77,90.3 64.13,89.66 40.01,89.66 39.37,89.03 39.37,73.15 31.75,65.53 12.7,65.53 12.06,64.9 12.06,50.93 11.43,50.29 IC306.5
N$100
  Top 0.305: R320.1 67.31,89.66 66.68,89.03 40.64,89.03 40.01,88.39 40.01,72.52 32.38,64.9 13.34,64.9 12.7,64.26 12.7,45.85 12.06,45.21 IC306.7
N$101
  Bottom 0.305: ST2.49 186.68,51.09 186.68,52.22 180.31,52.22 173.99,58.55 173.99,99.82 173.36,100.46 62.87,100.46 62.23,101.09 R318.2
N$102
  Top 0.305: R321.1 77.47,87.12 76.84,86.49 43.18,86.49 42.54,85.85 42.54,69.98 34.93,62.36 29.85,62.36 29.21,61.72 29.21,45.85 28.58,45.21 IC307.7
N$103
  Top 0.305: R322.1 74.93,87.76 74.29,87.12 42.54,87.12 41.91,86.49 41.91,70.61 34.29,62.99 29.21,62.99 28.58,62.36 28.58,50.93 27.94,50.29 IC307.5
N$104
  Top 0.305: R323.1 72.39,88.39 71.75,87.76 41.91,87.76 41.27,87.12 41.27,71.25 33.65,63.63 28.58,63.63 27.94,62.99 27.94,56.01 27.3,55.37 IC307.3
N$105
  Top 0.305: R324.1 69.85,89.03 69.22,88.39 41.27,88.39 40.64,87.76 40.64,71.88 33.02,64.26 27.94,64.26 27.3,63.63 27.3,61.09 26.67,60.45 IC307.1
N$106
  Bottom 0.305: ST2.27 181.01,54.71 174.62,61.09 174.62,100.46 173.99,101.09 65.41,101.09 64.77,101.73 R319.2
N$107
  Bottom 0.305: ST2.47 186.78,55.91 186.69,56.01 186.69,57.09 181.79,57.09 175.26,63.63 175.26,101.09 174.62,101.73 67.94,101.73 67.31,102.36 R320.2
N$108
  Top 0.305: ST2.3 180.05,60.74 177.8,62.99 177.8,96.65 177.17,97.28 78.1,97.28 77.47,97.92 R321.2
N$109
  Top 0.305: ST2.46 186.72,58.32 186.72,59.5 180.03,59.5 177.17,62.36 177.17,96.01 176.53,96.65 75.56,96.65 74.93,97.28 R322.2
N$110
  Top 0.305: ST2.4 179.29,58.32 176.53,61.09 176.53,95.38 175.9,96.01 73.03,96.01 72.39,96.65 R323.2
N$111
  Bottom 0.305: ST2.25 182.53,59.53 175.9,66.17 175.9,101.73 175.26,102.36 70.49,102.36 69.85,103 R324.2
N$112
  Top 0.305: ST2.26 178.59,57.12 175.9,59.82 175.9,94.74 175.26,95.38 59.05,95.38 58.42,94.74 58.42,92.2 57.79,91.57 38.1,91.57 37.46,90.93 37.46,75.06 29.85,67.44 4.45,67.44 3.81,66.8 3.81,57.91 | IC306.8 4.45,42.67 3.81,43.31 3.81,47.75 | 3.81,47.75 IC306.6 | 3.81,52.83 3.81,47.75 | 3.81,52.83 IC306.4 | 3.81,57.91 3.81,52.83 | 3.81,57.91 IC306.2 | IC307.8 20.95,42.67 20.32,43.31 20.32,47.75 | 20.32,47.75 IC307.6 | 20.32,47.75 20.32,52.83 | 20.32,52.83 IC307.4 | 20.32,52.83 20.32,57.28 20.95,57.91 IC307.2
  Bottom 0.305: IC306.8 6.35,42.04 6.98,41.4 22.23,41.4 22.86,42.04 IC307.8
N$113
  Bottom 0.305: 184.61,95.38 185.42,93.34 186.23,95.38 185.42,97.41 182.98,91.31 185.42,99.44 186.64,96.39
N$114
  Bottom 0.305: 186.23,95.37 186.46,94.8
N$115
  Bottom 0.305: 186.64,96.39 187.84,99.4
N$116
  Bottom 0.305: 186.65,96.38 186.81,95.97
N$121
  Top 0.305: R310.1 82.55,85.22 81.91,84.58 45.09,84.58 44.45,83.95 44.45,68.07 36.83,60.45 36.83,38.86 35.56,37.59 12.06,37.59 11.43,36.96 11.43,25.53 10.8,24.89 IC304.3
N$122
  Top 0.305: R309.1 80.01,85.85 79.38,85.22 44.45,85.22 43.82,84.58 43.82,68.71 36.2,61.09 36.2,39.5 34.93,38.23 11.43,38.23 10.8,37.59 10.8,30.61 10.16,29.97 IC304.1
N$123
  Top 0.305: ST2.24 180.75,61.95 178.44,64.26 178.44,97.28 177.8,97.92 80.65,97.92 80.01,98.55 R309.2
N$124
  Top 0.305: ST2.2 181.45,63.15 179.07,65.53 179.07,97.92 178.44,98.55 83.19,98.55 82.55,99.19 R310.2
N$125
  Top 0.305: ST2.44 186.69,63.15 186.69,64.34 182.16,64.34 179.71,66.8 179.71,98.55 179.07,99.19 177.17,99.19 | 177.17,99.19 126.37,99.19 | 177.17,99.19 85.72,99.19 85.09,99.82 R311.2
N$126
  Top 0.305: ST2.1 182.85,65.56 180.34,68.07 180.34,99.19 179.71,99.82 177.8,99.82 | 177.8,99.82 126.37,99.82 | 177.8,99.82 88.27,99.82 87.63,100.46 R312.2
N$127  (via drill 0.61)
  Top 0.305: v186.69,89.03 186.69,101.73 186.06,102.36 98.43,102.36 97.79,103 R313.2
  Bottom 0.305: ST2.43 186.68,65.56 186.68,66.77 184.82,66.77 184.15,67.44 184.15,86.49 v186.69,89.03
N$128  (via drill 0.61)
  Top 0.305: v184.78,89.03 184.78,101.09 184.15,101.73 95.89,101.73 95.25,102.36 R314.2
  Bottom 0.305: ST2.23 182.78,64.36 182.25,64.9 182.25,86.49 v184.78,89.03
N$129  (via drill 0.61)
  Top 0.305: v182.88,89.03 182.88,100.46 182.25,101.09 93.34,101.09 92.71,101.73 R315.2
  Bottom 0.305: ST2.45 186.72,60.74 186.72,61.92 181.41,61.92 180.34,62.99 180.34,86.49 v182.88,89.03
N$130
  Top 0.305: ST2.22 183.55,66.77 180.97,69.34 180.97,99.82 180.34,100.46 90.81,100.46 90.17,101.09 R316.2
N$131
  Top 0.305: ST2.5 177.9,55.91 175.26,58.55 175.26,94.11 174.62,94.74 79.38,94.74 78.74,94.11 78.74,86.49 78.1,85.85 43.82,85.85 43.18,85.22 43.18,69.34 35.56,61.72 35.56,40.13 34.29,38.86 4.45,38.86 3.81,38.23 3.81,27.43 | IC304.8 4.45,12.19 3.81,12.83 3.81,17.27 | 3.81,17.27 IC304.6 | 3.81,22.35 3.81,17.27 | 3.81,22.35 IC304.4 | 3.81,27.43 3.81,22.35 | 3.81,27.43 IC304.2 | IC305.2 20.95,27.43 20.32,26.8 20.32,22.35 | 20.32,22.35 IC305.4 | 20.32,17.27 20.32,22.35 | 20.32,17.27 IC305.6 | 20.32,17.27 20.32,12.83 20.95,12.19 IC305.8
  Bottom 0.305: IC305.8 22.86,11.56 22.23,10.92 6.98,10.92 6.35,11.56 IC304.8
N$140
  Top 0.305: R301.1 39.37,94.11 38.74,94.74 29.21,94.74 28.58,94.11 28.58,78.87 27.94,78.23 IC302.7
N$141
  Top 0.305: R302.1 41.91,96.65 41.27,97.28 28.58,97.28 27.94,96.65 27.94,83.95 27.3,83.31 IC302.5
N$142
  Top 0.305: R303.1 44.45,97.28 43.82,97.92 27.94,97.92 27.3,97.28 27.3,89.03 26.67,88.39 IC302.3
N$143
  Top 0.305: R304.1 46.99,97.92 46.35,98.55 27.3,98.55 26.67,97.92 26.67,94.11 26.04,93.47 IC302.1
N$144
  Top 0.305: R305.1 57.15,100.46 56.52,101.09 11.43,101.09 10.8,100.46 10.8,94.11 10.16,93.47 IC303.1
N$145
  Top 0.305: R306.1 54.61,99.82 53.98,100.46 12.06,100.46 11.43,99.82 11.43,89.03 10.8,88.39 IC303.3
N$146
  Top 0.305: R307.1 52.07,99.19 51.43,99.82 12.7,99.82 12.06,99.19 12.06,83.95 11.43,83.31 IC303.5
N$147
  Top 0.305: R308.1 49.53,98.55 48.9,99.19 13.34,99.19 12.7,98.55 12.7,78.87 12.06,78.23 IC303.7
N$148
  Bottom 0.305: ST2.37 174.66,30.58 168.28,36.96 168.28,94.11 167.64,94.74 40.01,94.74 39.37,95.38 R301.2
N$149
  Bottom 0.305: ST2.57 186.72,31.78 186.72,33.07 175.34,33.07 168.91,39.5 168.91,94.74 168.28,95.38 42.54,95.38 41.91,96.01 R302.2
N$150
  Bottom 0.305: ST2.35 176.18,35.4 169.55,42.04 169.55,95.38 168.91,96.01 45.09,96.01 44.45,96.65 R303.2
N$151
  Bottom 0.305: ST2.55 186.72,36.61 186.72,37.77 176.35,37.77 170.18,43.94 170.18,96.01 169.55,96.65 47.63,96.65 46.99,97.28 R304.2
N$152
  Bottom 0.305: ST2.51 186.72,46.26 186.72,47.47 179.35,47.47 172.72,54.1 172.72,98.55 172.09,99.19 57.79,99.19 57.15,99.82 R305.2
N$153
  Bottom 0.305: ST2.31 178.59,45.05 172.09,51.56 172.09,97.92 171.45,98.55 55.24,98.55 54.61,99.19 R306.2
N$154
  Bottom 0.305: ST2.53 186.68,41.43 186.68,42.67 177.8,42.67 171.45,49.02 171.45,97.28 170.81,97.92 52.71,97.92 52.07,98.55 R307.2
N$155
  Bottom 0.305: ST2.33 177.07,40.23 170.81,46.48 170.81,96.65 170.18,97.28 50.16,97.28 49.53,97.92 R308.2
N$156  (via drill 0.61)
  Top 0.305: v20.95,94.11 20.95,90.93 | 20.95,90.93 IC302.2 | 20.95,90.93 20.95,85.85 | 20.95,85.85 IC302.4 | 20.95,85.85 20.95,80.77 | 20.95,80.77 IC302.6 | 20.95,80.77 20.95,76.33 21.59,75.69 IC302.8
  Bottom 0.305: ST2.59 186.68,26.96 186.68,28.17 173.89,28.17 167.64,34.42 167.64,92.84 167,93.47 100.97,93.47 99.06,91.57 38.74,91.57 38.1,92.2 38.1,94.11 37.46,94.74 21.59,94.74 v20.95,94.11 20.32,94.74 5.08,94.74 4.45,94.11 4.45,85.85 | IC303.8 5.08,75.69 4.45,76.33 4.45,80.77 | 4.45,80.77 IC303.6 | 4.45,85.85 4.45,80.77 | 4.45,85.85 IC303.4 | IC303.2 4.45,90.93 4.45,85.85
PA0
  Bottom 0.305: IC201.4 75.56,71.88 76.2,72.52 76.2,80.77 76.84,81.41 90.81,81.41 91.44,80.77 91.44,76.33 92.07,75.69 98.43,75.69 99.06,75.06 IC202.2
PA1
  Bottom 0.305: IC201.3 74.29,74.42 74.93,75.06 74.93,81.41 75.56,82.04 91.44,82.04 92.07,81.41 92.07,76.96 92.71,76.33 103.5,76.33 104.14,75.69 IC202.4
PA2
  Bottom 0.305: IC201.2 73.03,76.96 73.66,77.6 73.66,82.04 74.29,82.68 92.07,82.68 92.71,82.04 92.71,77.6 93.34,76.96 108.59,76.96 109.22,76.33 IC202.6
PA3
  Bottom 0.305: IC201.1 71.12,82.68 71.75,83.31 92.71,83.31 93.34,82.68 93.34,78.23 93.98,77.6 113.67,77.6 114.3,76.96 IC202.8
PA4
  Bottom 0.305: IC201.40 90.17,79.5 90.81,78.87 90.81,69.34 91.44,68.71 122.56,68.71 123.19,69.34 123.19,72.52 IC203.2
PA5
  Bottom 0.305: IC201.39 89.53,76.96 90.17,76.33 90.17,68.71 90.81,68.07 127.64,68.07 128.27,68.71 128.27,72.52 IC203.4
PA6
  Bottom 0.305: IC201.38 88.9,74.42 89.53,73.79 89.53,68.07 90.17,67.44 132.72,67.44 133.35,68.07 133.35,72.52 IC203.6
PA7
  Bottom 0.305: IC201.37 88.27,71.88 88.9,71.25 88.9,67.44 89.53,66.8 137.8,66.8 138.43,67.44 138.43,72.52 IC203.8
PAI0
  Bottom 0.305: IC302.10 RN301.8 37.46,78.23 38.1,77.6 38.1,69.98 38.74,69.34 IC301.4
PAI1
  Bottom 0.305: IC302.12 RN301.6 40.01,83.31 40.64,82.68 40.64,72.52 41.27,71.88 IC301.3
PAI2
  Bottom 0.305: IC302.14 RN301.4 42.54,88.39 43.18,87.76 43.18,75.06 43.82,74.42 IC301.2
PAI3
  Bottom 0.305: IC302.16 RN301.2 38.1,90.93 45.09,90.93 45.72,90.3 45.72,77.6 46.35,76.96 IC301.1
PAI4
  Bottom 0.305: IC303.16 17.78,93.47 19.05,92.2 34.29,92.2 RN301.3 36.83,90.93 38.1,89.66 43.82,89.66 44.45,89.03 44.45,76.33 45.09,75.69 60.96,75.69 62.23,76.96 IC301.40
PAI5
  Bottom 0.305: IC303.14 17.78,88.39 19.05,87.12 34.29,87.12 RN301.5 41.27,85.85 41.91,85.22 41.91,73.79 42.54,73.15 60.96,73.15 62.23,74.42 IC301.39
PAI6
  Bottom 0.305: IC303.12 17.78,83.31 19.05,82.04 34.29,82.04 RN301.7 38.74,80.77 39.37,80.14 39.37,71.25 40.01,70.61 60.96,70.61 62.23,71.88 IC301.38
PAI7
  Bottom 0.305: IC303.10 17.78,78.23 19.05,76.96 34.29,76.96 RN301.9 35.56,68.71 36.2,68.07 60.96,68.07 62.23,69.34 IC301.37
PB0  (via drill 0.61)
  Top 0.305: v99.06,35.05 99.7,35.05 100.97,33.78 v101.6,33.78
  Bottom 0.305: IC201.18 74.29,36.32 75.56,35.05 v99.06,35.05 | v101.6,33.78 102.87,33.78 107.31,38.23 147.96,38.23 148.59,38.86 148.59,44.58 IC204.2
PB1
  Bottom 0.305: IC201.19 74.29,33.78 75.56,32.51 102.87,32.51 107.95,37.59 153.03,37.59 153.67,38.23 153.67,44.58 IC204.4
PB2
  Bottom 0.305: IC201.20 83.82,31.24 85.09,29.97 102.87,29.97 109.22,36.32 163.2,36.32 163.83,36.96 163.83,44.58 IC204.8
PB3
  Bottom 0.305: IC201.21 102.87,31.24 108.59,36.96 158.12,36.96 158.75,37.59 158.75,44.58 IC204.6
PB4
  Bottom 0.305: IC201.22 99.7,33.78 100.97,35.05 102.87,35.05 106.68,38.86 137.8,38.86 138.43,39.5 138.43,44.58 IC205.8
PB5
  Bottom 0.305: IC201.23 102.87,36.32 106.05,39.5 132.72,39.5 133.35,40.13 133.35,44.58 IC205.6
PB6
  Bottom 0.305: IC201.24 95.89,38.86 96.52,38.23 103.5,38.23 105.41,40.13 127.64,40.13 128.27,40.77 128.27,44.58 IC205.4
PB7
  Bottom 0.305: IC201.25 88.27,41.4 88.9,40.77 122.56,40.77 123.19,41.4 123.19,44.58 IC205.2
PBI0
  Bottom 0.305: IC304.16 17.78,29.97 19.05,28.7 34.93,28.7 RN302.3 39.37,27.43 45.72,33.78 IC301.18
PBI1
  Bottom 0.305: IC304.14 17.78,24.89 19.05,26.16 34.93,26.16 RN302.4 39.37,24.89 45.72,31.24 IC301.19
PBI2
  Bottom 0.305: IC304.12 17.78,19.81 19.69,21.08 33.65,21.08 35.56,19.81 RN302.6 36.83,19.81 45.72,28.7 IC301.20
PBI3
  Bottom 0.305: IC304.10 17.78,14.73 19.05,13.46 34.29,13.46 35.56,12.19 RN302.9 41.27,12.19 41.91,12.83 41.91,21.08 45.72,24.89 58.42,24.89 62.23,28.7 IC301.21
PBI4
  Bottom 0.305: IC305.10 RN302.8 40.01,14.73 40.64,15.37 40.64,21.08 45.72,26.16 57.15,26.16 62.23,31.24 IC301.22
PBI5
  Bottom 0.305: IC305.12 33.65,19.81 RN302.7 38.74,17.27 39.37,17.91 39.37,21.08 45.72,27.43 55.88,27.43 62.23,33.78 IC301.23
PBI6
  Bottom 0.305: IC305.14 33.02,24.89 35.56,22.35 RN302.5 38.1,22.35 45.72,29.97 55.88,29.97 62.23,36.32 IC301.24
PBI7
  Bottom 0.305: IC305.16 RN302.2 40.64,29.97 45.72,35.05 58.42,35.05 62.23,38.86 IC301.25
PC0
  Bottom 0.305: IC201.14 82.55,46.48 83.82,47.75 91.44,47.75 93.98,50.29 113.67,50.29 114.3,49.66 IC206.8
PC1
  Bottom 0.305: IC201.15 82.55,43.94 83.82,45.21 90.81,45.21 95.25,49.66 108.59,49.66 109.22,49.02 IC206.6
PC2
  Bottom 0.305: IC201.16 83.82,41.4 85.09,42.67 89.53,42.67 95.89,49.02 103.5,49.02 104.14,48.39 IC206.4
PC3  (via drill 0.61)
  Top 0.305: IC206.2 97.79,44.58 v97.79,39.5
  Bottom 0.305: IC201.17 82.55,38.86 83.82,40.13 97.16,40.13 v97.79,39.5
PC4
  Bottom 0.305: IC201.13 82.55,49.02 83.82,50.29 90.17,50.29 90.81,50.93 90.81,63.63 91.44,64.26 163.2,64.26 163.83,64.9 163.83,72.52 IC207.8
PC5
  Bottom 0.305: IC201.12 82.55,51.56 83.82,52.83 89.53,52.83 90.17,53.47 90.17,64.26 90.81,64.9 158.12,64.9 158.75,65.53 158.75,72.52 IC207.6
PC6
  Bottom 0.305: IC201.11 82.55,54.1 83.82,55.37 88.9,55.37 89.53,56.01 89.53,64.9 90.17,65.53 153.03,65.53 153.67,66.17 153.67,72.52 IC207.4
PC7
  Bottom 0.305: IC201.10 82.55,56.64 83.82,57.91 88.27,57.91 88.9,58.55 88.9,65.53 89.53,66.17 147.96,66.17 148.59,66.8 148.59,72.52 IC207.2
PCI0
  Bottom 0.305: IC306.16 16.51,60.45 17.78,59.18 27.94,59.18 28.58,58.55 28.58,41.4 29.21,40.77 34.29,40.77 37.46,43.94 RN303.6 | RN303.6 IC301.14 RN303.6
PCI1
  Bottom 0.305: IC306.14 16.51,55.37 17.78,56.64 27.3,56.64 27.94,56.01 27.94,40.77 28.58,40.13 34.93,40.13 36.2,41.4 RN303.7 44.45,40.13 49.53,40.13 IC301.15
PCI2
  Bottom 0.305: IC306.12 16.51,50.29 17.78,49.02 26.67,49.02 27.3,48.39 27.3,39.5 27.94,38.86 RN303.8 IC301.16
PCI3
  Bottom 0.305: IC306.10 16.51,45.21 17.78,46.48 26.04,46.48 26.67,45.85 26.67,36.96 27.3,36.32 RN303.9 IC301.17
PCI4
  Bottom 0.305: IC307.10 38.1,45.21 39.37,46.48 RN303.5 44.45,47.75 49.53,47.75 IC301.13
PCI5
  Bottom 0.305: IC307.12 38.1,50.29 39.37,49.02 RN303.4 IC301.12
PCI6
  Bottom 0.305: IC307.14 35.56,55.37 39.37,51.56 RN303.3 IC301.11
PCI7
  Bottom 0.305: IC307.16 33.02,60.45 39.37,54.1 RN303.2 IC301.10
RD  (via drill 0.61)
  Top 0.305: v55.88,19.81 55.24,19.81 54.61,20.45 54.61,26.16 56.52,28.07 56.52,66.17 55.88,66.8 IC301.5 | v139.7,9.02 139.06,9.02 138.43,9.65 v138.43,13.46 138.43,19.18 137.8,19.81 v137.16,19.81 | v78.74,18.54 IC104.1 v78.74,18.54
  Bottom 0.305: IC301.5 62.23,66.8 63.5,68.07 67.94,68.07 69.22,69.34 IC201.5 | v55.88,19.81 55.88,19.18 56.52,18.54 v78.74,18.54 100.33,18.54 101.6,17.27 136.53,17.27 137.16,17.91 v137.16,19.81 | v139.7,9.02 ST1.B14 | v138.43,13.46 142.24,13.46 143.51,14.73 147.32,14.73 148.59,16 IC101.1
RES  (via drill 0.61)
  Top 0.305: IC201.35 88.9,66.8 89.53,66.17 89.53,47.75 91.44,45.21 91.44,35.05 92.07,34.42 97.79,34.42 99.7,32.51 99.7,14.73 100.33,14.1 v104.78,14.1 | v174.62,12.83 174.62,10.29 173.99,9.65 v171.45,9.65
  Bottom 0.305: IC301.35 67.94,64.26 69.22,65.53 83.82,65.53 85.09,66.8 IC201.35 | v171.45,9.65 170.81,9.65 170.18,9.02 ST1.B2 | v174.62,12.83 173.99,13.46 143.51,13.46 142.24,12.19 137.16,12.19 135.89,10.92 105.41,10.92 104.78,11.56 v104.78,14.1
S$69
  Bottom 0.305: 184.03,94.8 182.98,97.41 180.54,91.31 178.11,99.44 180.54,93.34 182.98,99.44 184.38,95.96
S$70
  Bottom 0.305: 187.86,99.44 186.81,95.96 187.86,93.34 190.3,99.44 192.74,91.31 190.3,97.41 187.86,91.31 186.47,94.8 185.42,91.31 184.2,94.36
WR  (via drill 0.61)
  Top 0.305: v58.42,19.81 57.79,19.81 57.15,20.45 57.15,24.89 59.05,26.8 59.05,66.17 59.69,66.8 IC301.36 | v139.7,21.08 139.7,12.83 142.24,10.29 v142.24,9.02 | v81.28,19.81 IC104.2 v81.28,19.81
  Bottom 0.305: IC301.36 67.94,66.8 69.22,68.07 83.82,68.07 85.09,69.34 IC201.36 | v58.42,19.81 v81.28,19.81 82.55,19.18 100.97,19.18 101.6,18.54 133.35,18.54 135.89,21.08 v139.7,21.08 | v142.24,9.02 ST1.B13

## Text on the board
Top: PL20_11 | pos. Logik | BS | I/O-48
Bottom: LS
tPlace: PL20_11 | pos. Logik | I/O-48
Document: Widerstände mit Abstand einlöten ! | I/O 48 Rev.1.1